# Altium project Spectral.PrjPcb
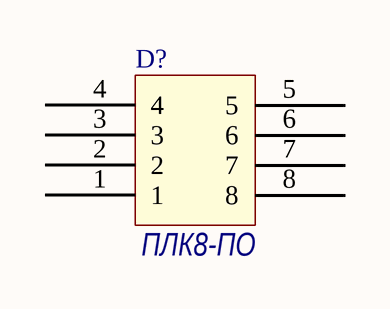
[diagram p0: Sheet1.SchDoc]
1 sheet, 1 parts. Net scope: global (net labels, ports and power ports of the same name join across sheets).
Board file: PCB1.PcbDoc

## Sheet Sheet1.SchDoc
size A4; SheetNumber: 1; SheetTotal: 1

### Parts
D?  ПЛК8-ПО  [ПЛК8-ПО]

### Nets

Not connected (* = marked no-connect by the designer): D? 1 2 3 4 5 6 7 8

### Library data of the parts
D? = ПЛК8_ПО